# EAGLE schematic scraptcha (EAGLE 6.3)
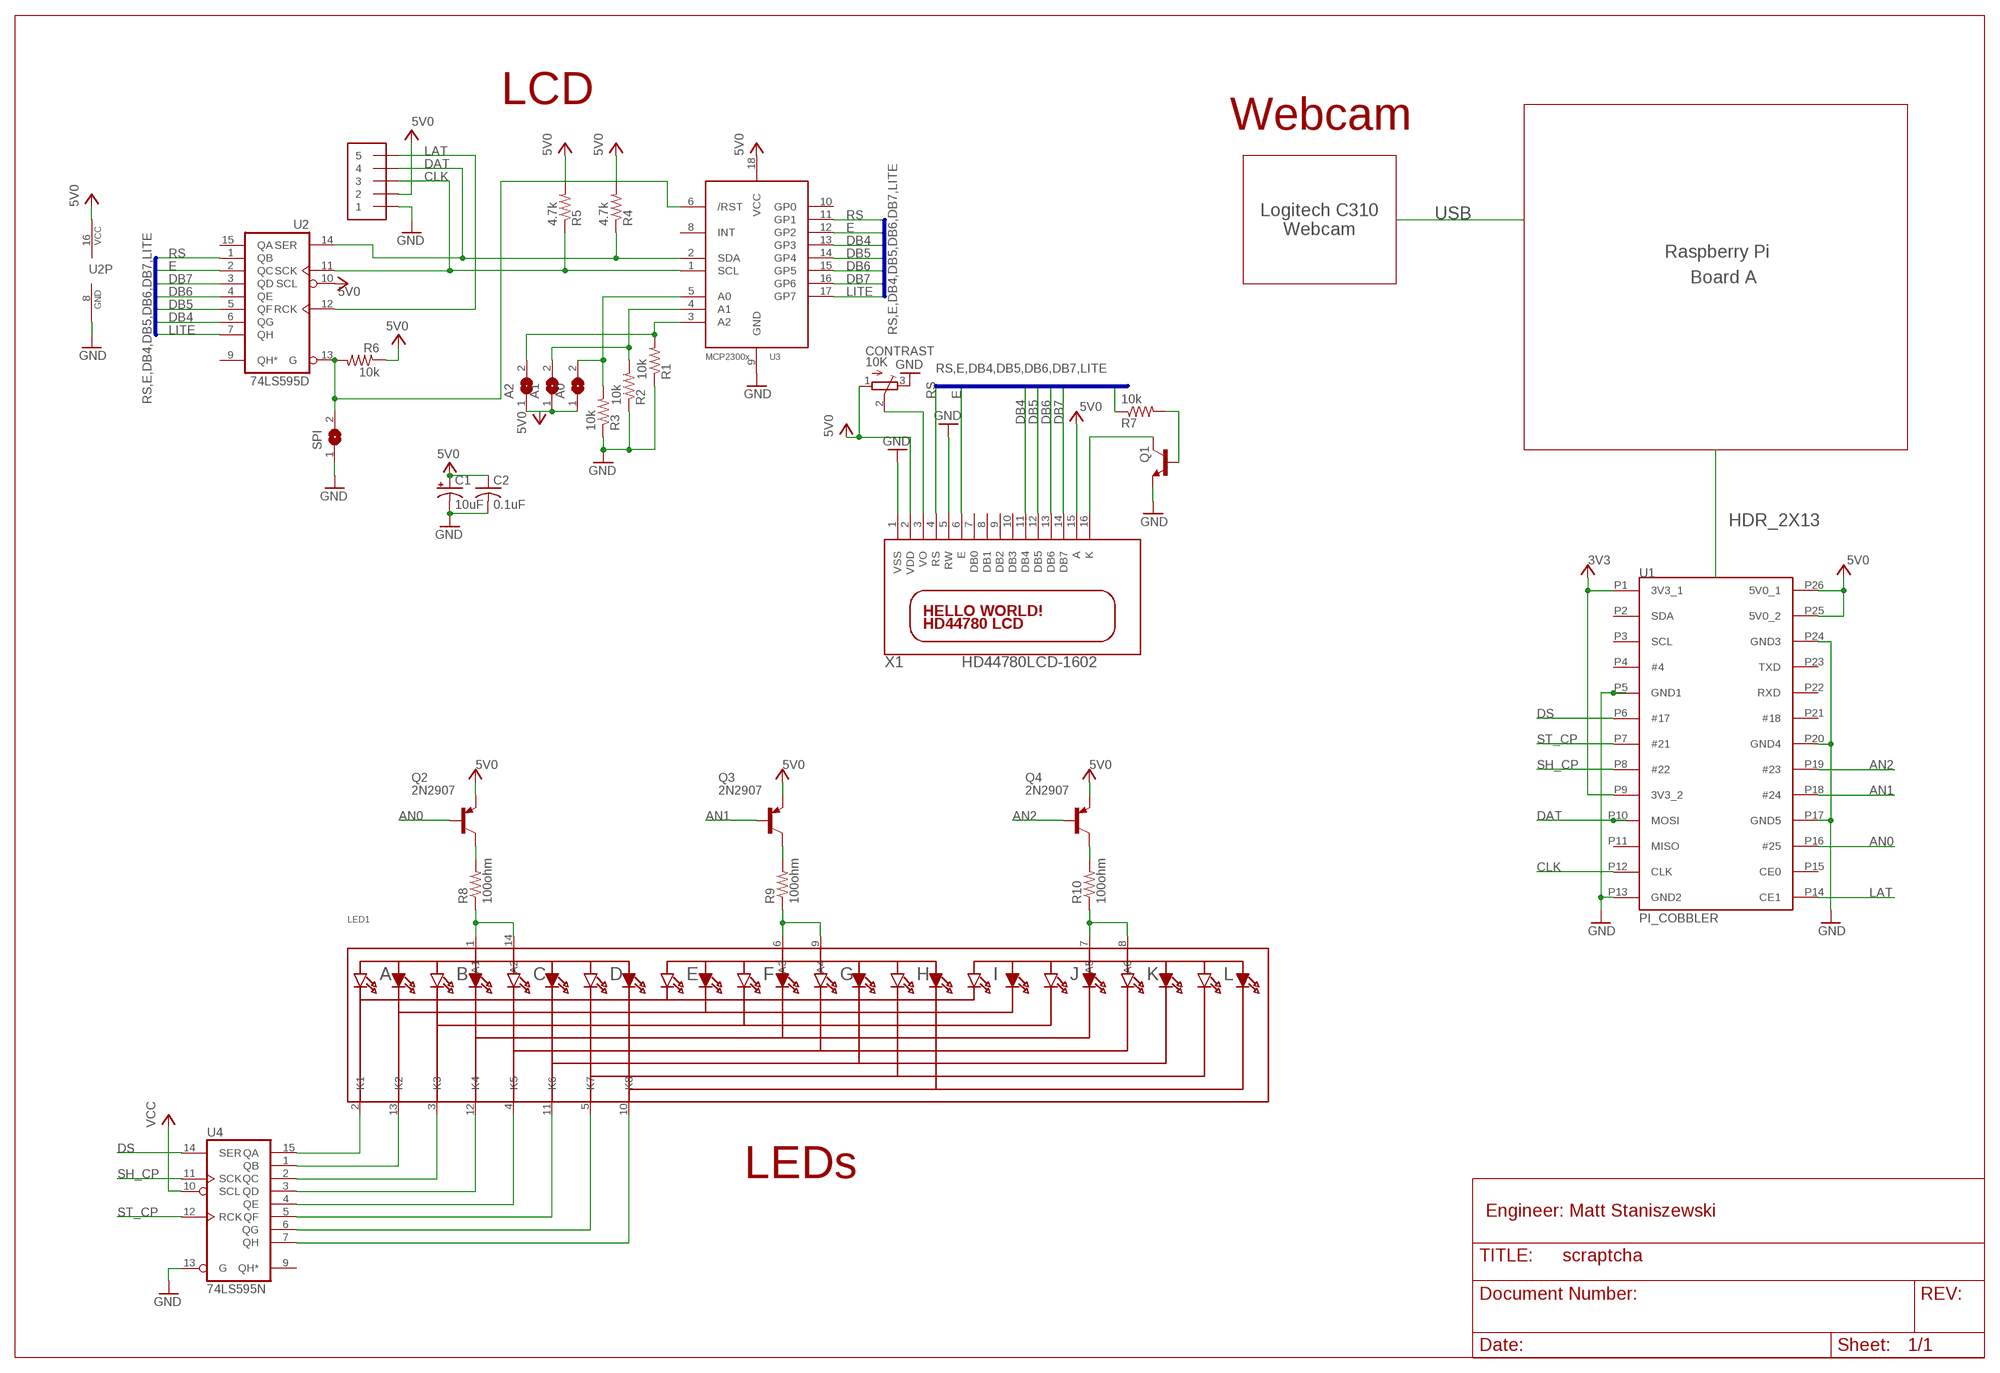
[diagram p0: schematic, sheet 1]

## Parts
A0  SJ  [SJ]
A1  SJ  [SJ]
A2  SJ  [SJ]
C1  10uF  CPOL-USA/3216-18R  [A/3216-18R]
C2  0.1uF  C-USC0805K  [C0805K]
CONTRAST  10K  TRIMPOTTC33X  [TC33X]
J1  1X5  [3.5MM-5P]
LED1  SEGMENT_12BAR_BICOLORAR12Z3010  [SEGMENT_BICOL_BL-AR12Z3010]
Q1  MMBT2222ALT1-NPN-SOT23-BEC  [SOT23-BEC]
Q2  2N2907  [TO92-EBC-OVAL]
Q3  2N2907  [TO92-EBC-OVAL]
Q4  2N2907  [TO92-EBC-OVAL]
R1  10k  R-US_R0805  [R0805]
R2  10k  R-US_R0805  [R0805]
R3  10k  R-US_R0805  [R0805]
R4  4.7k  R-US_R0805  [R0805]
R5  4.7k  R-US_R0805  [R0805]
R6  10k  R-US_R0805  [R0805]
R7  10k  R-US_R0805  [R0805]
R8  100ohm  R-US_0204/5  [0204/5]
R9  100ohm  R-US_0204/5  [0204/5]
R10  100ohm  R-US_0204/5  [0204/5]
SPI  SJ  [SJ]
U1  PI_COBBLER  [2X13_HDR]
U2  74LS595D  [SO16]
U3  MCP2300X/SO  [SO18W]
U4  74LS595N  [DIL16]
X1  HD44780LCD-1602  [LCD1602]

## Nets
AN0: Q2.B U1.P16(#25)
AN1: Q3.B U1.P18(#24)
AN2: Q4.B U1.P19(#23)
CLK: J1.3 R5.1 U1.P12(CLK) U2.11(SCK) U3.1(SCL)
DAT: J1.4 R4.1 U1.P10(MOSI) U2.14(SER) U3.2(SDA)
DB4: U2.6(QG) U3.13(GP3) X1.11(DB4)
DB5: U2.5(QF) U3.14(GP4) X1.12(DB5)
DB6: U2.4(QE) U3.15(GP5) X1.13(DB6)
DB7: U2.3(QD) U3.16(GP6) X1.14(DB7)
DS: U1.P6(#17) U4.14(SER)
E: U2.2(QC) U3.12(GP2) X1.6(E)
GND: C1.- C2.2 CONTRAST.3(E) J1.1 Q1.E R1.1 R2.1 R3.1 SPI.1 U1.P5(GND1) U1.P13(GND2) U1.P17(GND5) U1.P20(GND4) U1.P24(GND3) U2.8(GND) U3.9(GND) U4.13(G) X1.1(VSS) X1.5(RW)
LAT: J1.5 U1.P14(CE1) U2.12(RCK)
LITE: R7.1 U2.7(QH) U3.17(GP7)
N$1: A0.2 R3.2 U3.5(A0)
N$2: A1.2 R2.2 U3.4(A1)
N$3: A2.2 R1.2 U3.3(A2)
N$4: Q2.C R8.2
N$5: LED1.1(A1) LED1.14(A2) R8.1
N$6: R6.2 SPI.2 U2.13(G) U3.6(/RST)
N$7: Q1.C X1.16(K)
N$8: LED1.2(K1) U4.15(QA)
N$9: Q1.B R7.2
N$10: CONTRAST.2(S) X1.3(VO)
N$11: Q3.C R9.2
N$12: LED1.6(A3) LED1.9(A4) R9.1
N$13: LED1.13(K2) U4.1(QB)
N$14: Q4.C R10.2
N$15: LED1.7(A5) LED1.8(A6) R10.1
N$16: LED1.3(K3) U4.2(QC)
N$17: LED1.12(K4) U4.3(QD)
N$18: LED1.4(K5) U4.4(QE)
N$19: LED1.11(K6) U4.5(QF)
N$20: LED1.5(K7) U4.6(QG)
N$21: LED1.10(K8) U4.7(QH)
RS: U2.1(QB) U3.11(GP1) X1.4(RS)
SH_CP: U1.P8(#22) U4.11(SCK)
ST_CP: U1.P7(#21) U4.12(RCK)
VCC: A0.1 A1.1 A2.1 C1.+ C2.1 CONTRAST.1(A) J1.2 Q2.E Q3.E Q4.E R4.2 R5.2 R6.1 U1.P1(3V3_1) U1.P9(3V3_2) U1.P25(5V0_2) U1.P26(5V0_1) U2.10(SCL) U2.16(VCC) U3.18(VCC) U4.10(SCL) X1.2(VDD) X1.15(A) ; supply symbol labelled 5V0, 3V3
Unconnected: U1.P2(SDA) U1.P3(SCL) U1.P4(#4) U1.P11(MISO) U1.P15(CE0) U1.P21(#18) U1.P22(RXD) U1.P23(TXD) U2.9(QH*) U2.15(QA) U3.8(INT) U3.10(GP0) U4.9(QH*) X1.7(DB0) X1.8(DB1) X1.9(DB2) X1.10(DB3)

## Buses
RS,E,DB4,DB5,DB6,DB7,LITE

## Notes on the sheet
- LCD
- Webcam
- Logitech C310
  Webcam
- Raspberry Pi
- Board A
- LEDs
- Engineer: Matt Staniszewski

## Power pins joined to a net without a drawn wire
GND: U4.8(GND)
VCC: U4.16(VCC)

## Library data of the parts
A0 A1 A2 SPI = jumper:SJ: SMD solder JUMPER
C1 = adafruit:CPOL-US: POLARIZED CAPACITOR, American symbol
C2 = adafruit:C-US: CAPACITOR, American symbol
CONTRAST = adafruit:TRIMPOT: SMT trimmer potentiometer part number TC33X http://www.ladyada.net/library/eagle
J1 = adafruit:1X5
LED1 = adafruit:SEGMENT_12BAR_BICOLOR: 12-Bar Bi-Color LED Segment Displays: Row = Cathode 30.2 x 10.1mm Bi-Color 12 LED Bar Graph, 5.0 x 1.74mm Square LEDs - BL-AR12Z3010
Q1 = transistor:*-NPN-: NPN Transistror BF959 corrected 2008.03.06
Q2-Q4 = adafruit:2N2907*: PNP Transistor Big Oval pads
R1-R10 = adafruit:R-US_: RESISTOR, American symbol
U1 = scraptcha:PI_COBBLER
U2 U4 = 74xx-us:74*595: 8-bit SHIFT REGISTER, output latch
U3 = adafruit:MCP2300X: MCP23008 Inexpensive i2c i/o expander - 8 general purpose i/o pins with optional pullups
X1 = adafruit:HD44780LCD: HD44780 LCD Standard character type LCDs, available in sizes from 8x1 to 40x4!